# EAGLE schematic micro2 (EAGLE 7.6.0)
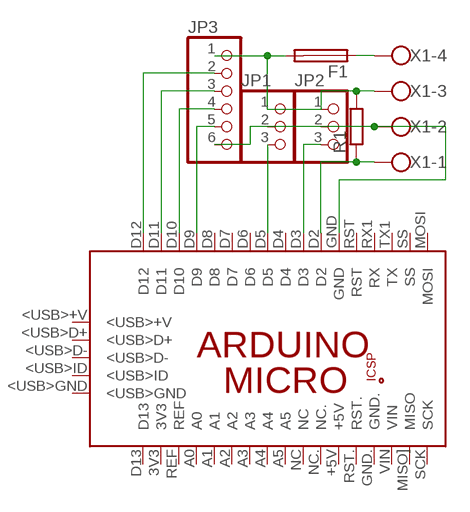
[diagram p0: schematic, sheet 1]

## Parts
F1  GSH15  [GSH15]
JP1  PINHD-1X3  [1X03]
JP2  PINHD-1X3  [1X03]
JP3  PINHD-1X6  [1X06]
PCB1  ARDUINO_MICRO  [ARDUINO_MICRO]
R1  R-EU_0207/10  [0207/10]
X1  W237-4  [W237-4]

## Nets
N$1: JP1.3 PCB1.D5
N$2: F1.2 JP1.1 JP2.1 JP3.1 R1.2 X1.3
N$3: JP1.2 JP2.2 JP3.6 PCB1.GND X1.2
N$4: JP3.5 PCB1.D9
N$5: JP3.4 PCB1.D10
N$6: JP3.3 PCB1.D11
N$7: JP3.2 PCB1.D12
N$8: F1.1 X1.4
N$9: JP2.3 PCB1.D3
N$11: PCB1.D2 R1.1 X1.1
Unconnected: PCB1.3V3 PCB1.5V PCB1.+5V PCB1.<USB>+V PCB1.<USB>D+ PCB1.<USB>D- PCB1.<USB>GND PCB1.<USB>ID PCB1.A0 PCB1.A1 PCB1.A2 PCB1.A3 PCB1.A4 PCB1.A5 PCB1.D4 PCB1.D6 PCB1.D7 PCB1.D8 PCB1.D13 PCB1.GND. PCB1.GND_ PCB1.MISO. PCB1.MISO](MISO) PCB1.MOSI PCB1.MOSI. PCB1.NC PCB1.NC. PCB1.REF PCB1.RESET.. PCB1.RST PCB1.RST. PCB1.RX1(RX) PCB1.SCK PCB1.SCK. PCB1.SS PCB1.TX1(TX) PCB1.VIN

## Library data of the parts
F1 = fuse:GSH15: FUSE HOLDER grid 15mm, 19649 Wickmann; MPN: 64900001039; OC_FARNELL: 1271673; OC_NEWARK: 02P0318
JP1 JP2 = pinhead:PINHD-1X3: PIN HEADER
JP3 = pinhead:PINHD-1X6: PIN HEADER
PCB1 = E14_Arduino_revB:ARDUINO_MICRO: Device for representing an Arduino Micro board with a footprint in an EAGLE design. Created by Dave Young for Element14. More EAGLE documentation at: http://www.element14.com/community/community/knode/cadsoft_eagle
R1 = resistor:R-EU_: RESISTOR, European symbol
X1 = con-wago-500:W237-4: WAGO SCREW CLAMP; OC_FARNELL: unknown; OC_NEWARK: unknown